# Altium schematic sheet ADC_Connector.SchDoc
size A
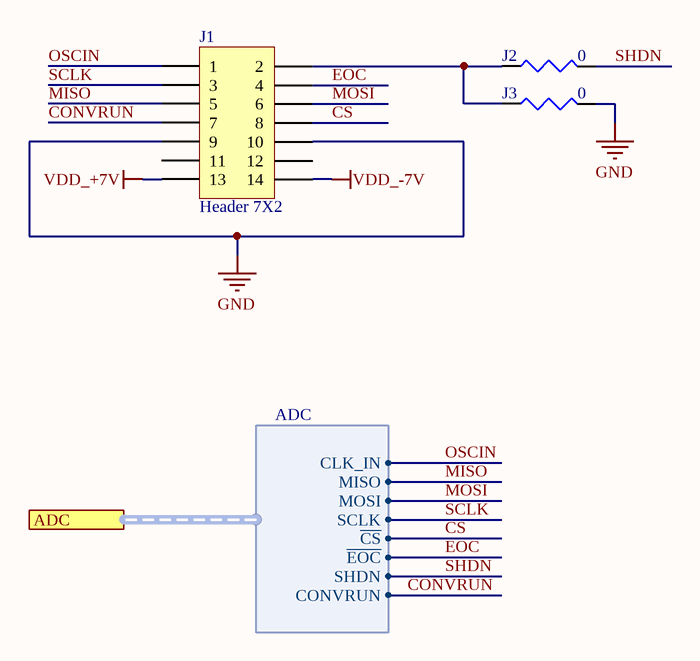
[diagram p0: ADC_Connector.SchDoc]

## Parts
J1  Header 7X2  [FLE-107-01-G-DV-A-TR]
J2  value 0  [J1-0603]  (hidden comment: Res3)
J3  value 0  [J1-0603]  (hidden comment: Res3)

## Ports
ADC (harness ADC)

## Harnesses
ADC: CLK_IN, MISO, MOSI, SCLK, ~{CS}, ~{EOC}, SHDN, CONVRUN

## Nets
GND: J1.9 J1.10 J3.2
VDD_+7V: J1.13
VDD_-7V: J1.14
~{CS}: J1.8 ; port ADC.~{CS}
CONVRUN: J1.7 ; port ADC.CONVRUN
~{EOC}: J1.4 ; port ADC.~{EOC}
MISO: J1.5 ; port ADC.MISO
MOSI: J1.6 ; port ADC.MOSI
OSCIN: J1.1 ; port ADC.CLK_IN
SCLK: J1.3 ; port ADC.SCLK
SHDN: J2.2 ; port ADC.SHDN
NetJ1_2: J1.2 J2.1 J3.1

Not connected (* = marked no-connect by the designer): J1 11 12

## Library data of the parts
J1 = Header 7X2: Header, 7-Pin, Dual row; LatestRevisionDate: 17-Jul-2002; LatestRevisionNote: Re-released for DXP Platform.; Publisher: Altium Limited
J2 J3 = Res3: Resistor; Published: 8-Jun-2000; LatestRevisionDate: 29-May-2009; LatestRevisionNote: IPC-7351 Footprint Added.; PackageReference: J1-0603; Publisher: Altium Limited; PackageDescription: Chip Resistor